# Altium project VENTUNOQ.PrjPcb (part 8 of 18)

## Sheet ETH_PHY.SchDoc: ETH PHY
size A3; Author: Silvio Navaretti; CompanyName: ARDUINO; DrawnBy: Silvio Navaretti; Engineer: Silvio Navaretti; Organization: ARDUINO; SheetNumber: 36; SheetTotal: 51; RevAuthor: Silvio Navaretti
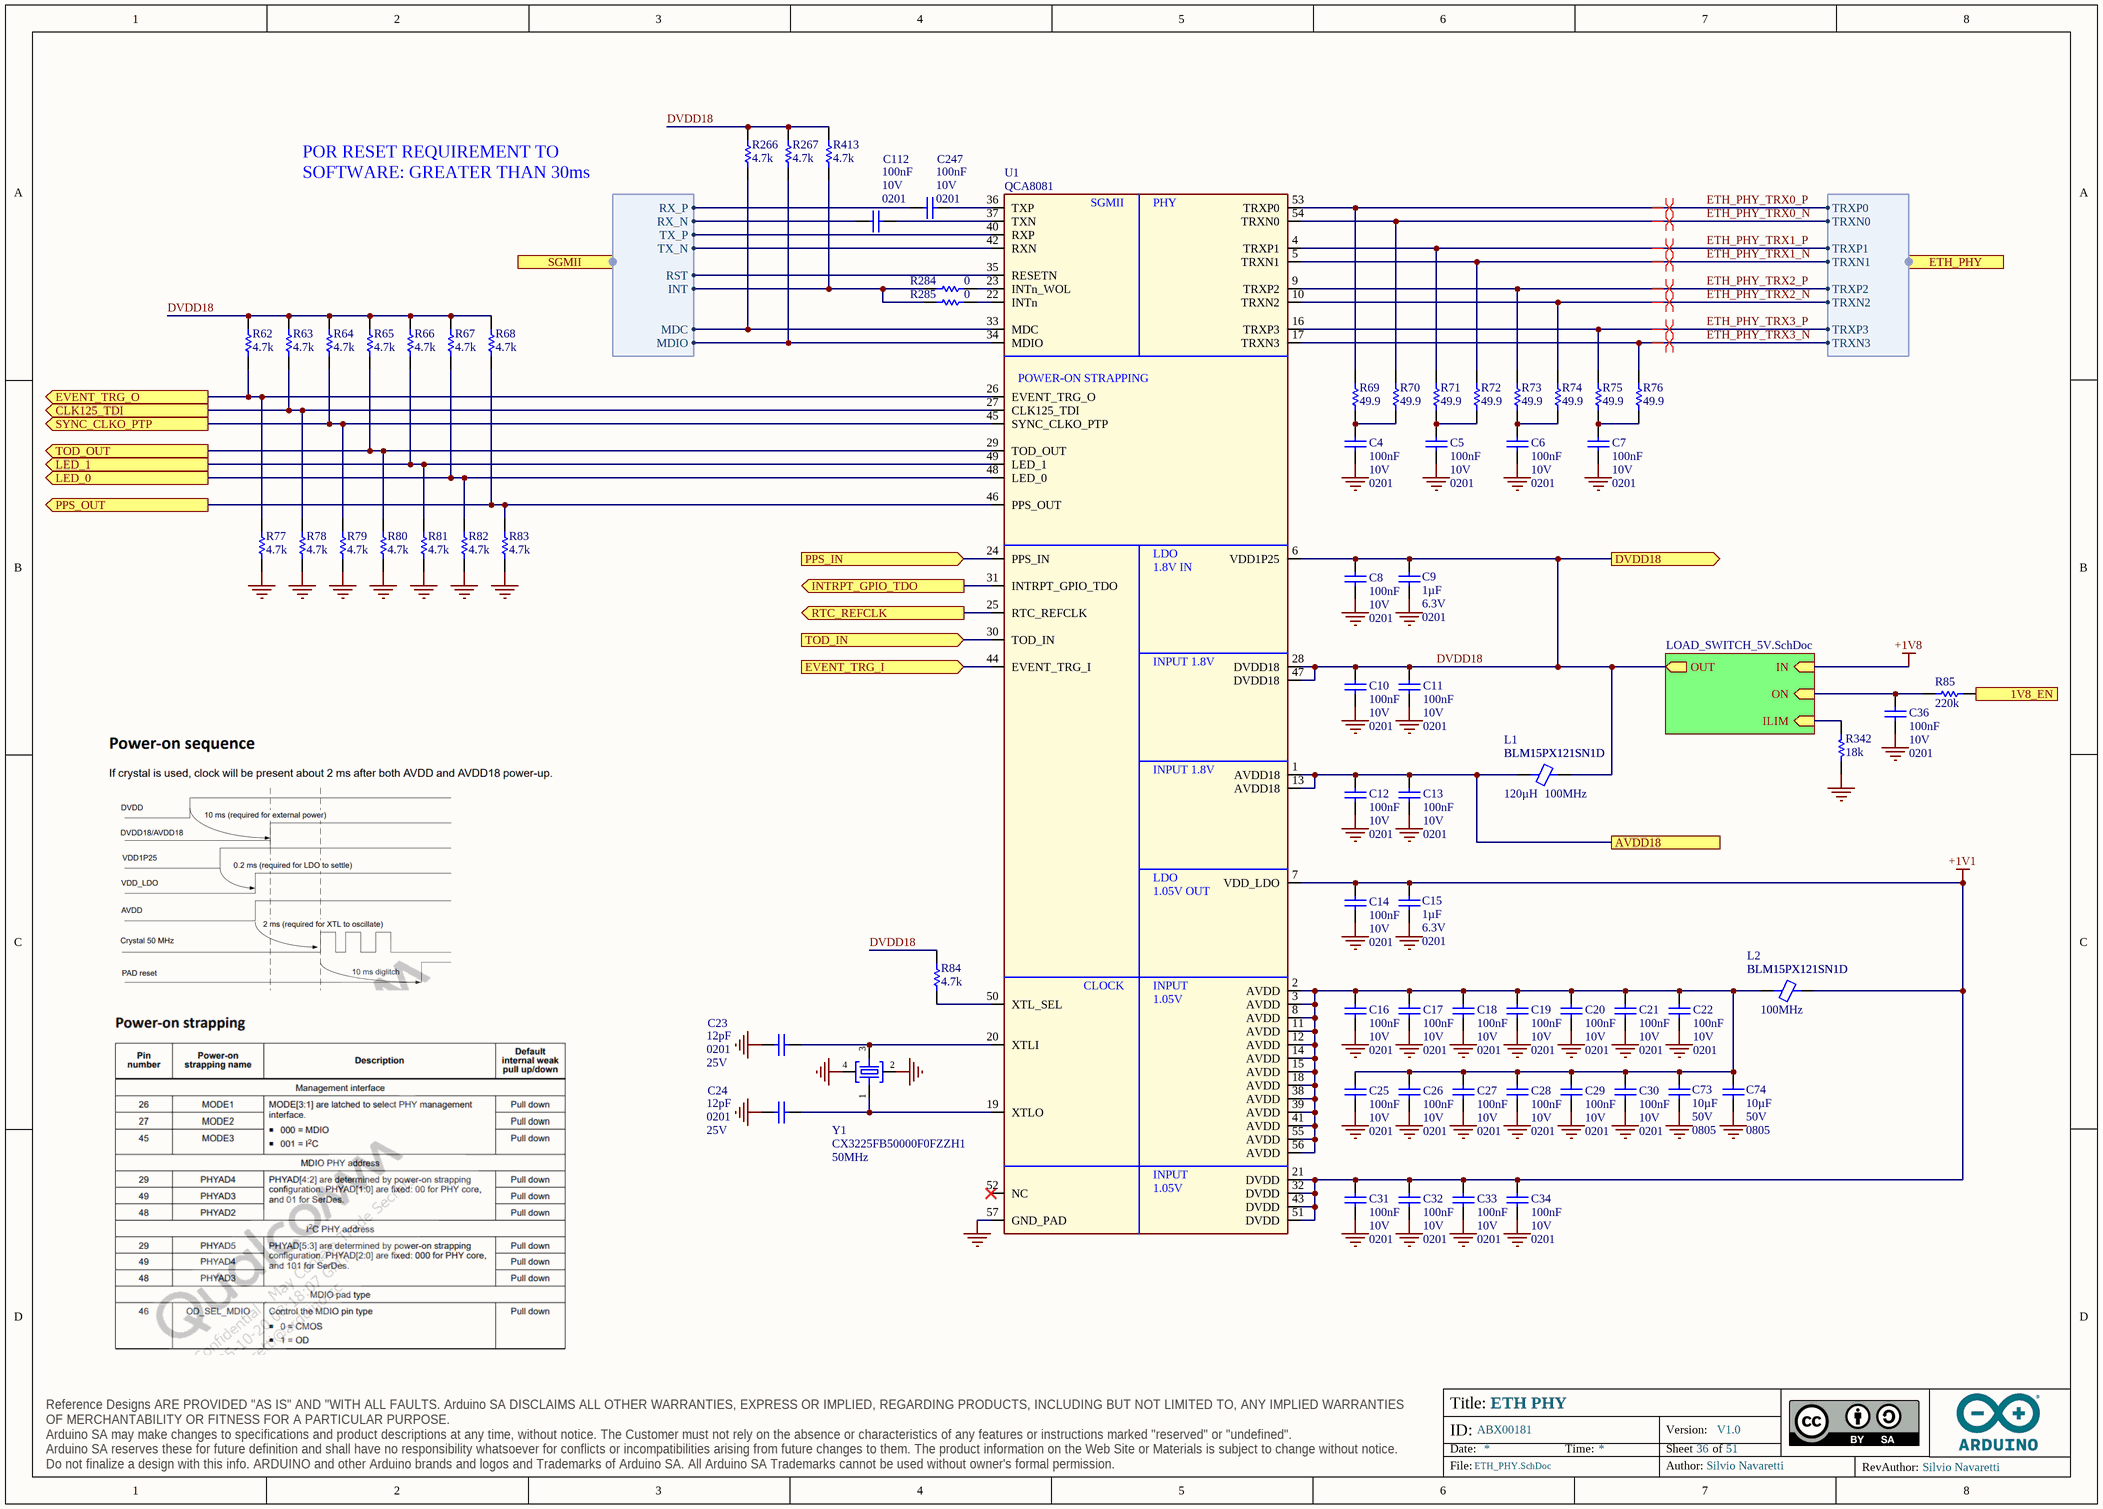
[diagram p19: ETH_PHY.SchDoc]

### Parts
C4  value 100nF  Voltage: 10V  Case Code (Imperial): 0201  [CAP-0201]  (hidden comment: CL03A104KP3NNNC)
C5  value 100nF  Voltage: 10V  Case Code (Imperial): 0201  [CAP-0201]  (hidden comment: CL03A104KP3NNNC)
C6  value 100nF  Voltage: 10V  Case Code (Imperial): 0201  [CAP-0201]  (hidden comment: CL03A104KP3NNNC)
C7  value 100nF  Voltage: 10V  Case Code (Imperial): 0201  [CAP-0201]  (hidden comment: CL03A104KP3NNNC)
C8  value 100nF  Voltage: 10V  Case Code (Imperial): 0201  [CAP-0201]  (hidden comment: CL03A104KP3NNNC)
C9  value 1µF  Voltage: 6.3V  Case Code (Imperial): 0201  [CAP-0201]  (hidden comment: GRM033R60J105MEA2D)
C10  value 100nF  Voltage: 10V  Case Code (Imperial): 0201  [CAP-0201]  (hidden comment: CL03A104KP3NNNC)
C11  value 100nF  Voltage: 10V  Case Code (Imperial): 0201  [CAP-0201]  (hidden comment: CL03A104KP3NNNC)
C12  value 100nF  Voltage: 10V  Case Code (Imperial): 0201  [CAP-0201]  (hidden comment: CL03A104KP3NNNC)
C13  value 100nF  Voltage: 10V  Case Code (Imperial): 0201  [CAP-0201]  (hidden comment: CL03A104KP3NNNC)
C14  value 100nF  Voltage: 10V  Case Code (Imperial): 0201  [CAP-0201]  (hidden comment: CL03A104KP3NNNC)
C15  value 1µF  Voltage: 6.3V  Case Code (Imperial): 0201  [CAP-0201]  (hidden comment: GRM033R60J105MEA2D)
C16  value 100nF  Voltage: 10V  Case Code (Imperial): 0201  [CAP-0201]  (hidden comment: CL03A104KP3NNNC)
C17  value 100nF  Voltage: 10V  Case Code (Imperial): 0201  [CAP-0201]  (hidden comment: CL03A104KP3NNNC)
C18  value 100nF  Voltage: 10V  Case Code (Imperial): 0201  [CAP-0201]  (hidden comment: CL03A104KP3NNNC)
C19  value 100nF  Voltage: 10V  Case Code (Imperial): 0201  [CAP-0201]  (hidden comment: CL03A104KP3NNNC)
C20  value 100nF  Voltage: 10V  Case Code (Imperial): 0201  [CAP-0201]  (hidden comment: CL03A104KP3NNNC)
C21  value 100nF  Voltage: 10V  Case Code (Imperial): 0201  [CAP-0201]  (hidden comment: CL03A104KP3NNNC)
C22  value 100nF  Voltage: 10V  Case Code (Imperial): 0201  [CAP-0201]  (hidden comment: CL03A104KP3NNNC)
C23  value 12pF  Case Code (Imperial): 0201  Voltage: 25V  [CAP-0201]  (hidden comment: GRM0335C1E120JA01J)
C24  value 12pF  Case Code (Imperial): 0201  Voltage: 25V  [CAP-0201]  (hidden comment: GRM0335C1E120JA01J)
C25  value 100nF  Voltage: 10V  Case Code (Imperial): 0201  [CAP-0201]  (hidden comment: CL03A104KP3NNNC)
C26  value 100nF  Voltage: 10V  Case Code (Imperial): 0201  [CAP-0201]  (hidden comment: CL03A104KP3NNNC)
C27  value 100nF  Voltage: 10V  Case Code (Imperial): 0201  [CAP-0201]  (hidden comment: CL03A104KP3NNNC)
C28  value 100nF  Voltage: 10V  Case Code (Imperial): 0201  [CAP-0201]  (hidden comment: CL03A104KP3NNNC)
C29  value 100nF  Voltage: 10V  Case Code (Imperial): 0201  [CAP-0201]  (hidden comment: CL03A104KP3NNNC)
C30  value 100nF  Voltage: 10V  Case Code (Imperial): 0201  [CAP-0201]  (hidden comment: CL03A104KP3NNNC)
C31  value 100nF  Voltage: 10V  Case Code (Imperial): 0201  [CAP-0201]  (hidden comment: CL03A104KP3NNNC)
C32  value 100nF  Voltage: 10V  Case Code (Imperial): 0201  [CAP-0201]  (hidden comment: CL03A104KP3NNNC)
C33  value 100nF  Voltage: 10V  Case Code (Imperial): 0201  [CAP-0201]  (hidden comment: CL03A104KP3NNNC)
C34  value 100nF  Voltage: 10V  Case Code (Imperial): 0201  [CAP-0201]  (hidden comment: CL03A104KP3NNNC)
C36  value 100nF  Voltage: 10V  Case Code (Imperial): 0201  [CAP-0201]  (hidden comment: CL03A104KP3NNNC)
C73  value 10µF  Voltage: 50V  Case Code (Imperial): 0805  [CAP-0805]  (hidden comment: GRM21BR61H106ME43L)
C74  value 10µF  Voltage: 50V  Case Code (Imperial): 0805  [CAP-0805]  (hidden comment: GRM21BR61H106ME43L)
C112  value 100nF  Voltage: 10V  Case Code (Imperial): 0201  [CAP-0201]  (hidden comment: CL03A104KP3NNNC)
C247  value 100nF  Voltage: 10V  Case Code (Imperial): 0201  [CAP-0201]  (hidden comment: CL03A104KP3NNNC)
L1  BLM15PX121SN1D  Inductance: 120µH  Test Frequency: 100MHz  [L-0402]
L2  BLM15PX121SN1D  Test Frequency: 100MHz  [L-0402]
R62  value 4.7k  [RES-0201]  (hidden comment: RC0201FR-074K7L)
R63  value 4.7k  [RES-0201]  (hidden comment: RC0201FR-074K7L)
R64  value 4.7k  [RES-0201]  (hidden comment: RC0201FR-074K7L)
R65  value 4.7k  [RES-0201]  (hidden comment: RC0201FR-074K7L)
R66  value 4.7k  [RES-0201]  (hidden comment: RC0201FR-074K7L)
R67  value 4.7k  [RES-0201]  (hidden comment: RC0201FR-074K7L)
R68  value 4.7k  [RES-0201]  (hidden comment: RC0201FR-074K7L)
R69  value 49.9  [RES-0201]  (hidden comment: AC0201FR-0749R9L)
R70  value 49.9  [RES-0201]  (hidden comment: AC0201FR-0749R9L)
R71  value 49.9  [RES-0201]  (hidden comment: AC0201FR-0749R9L)
R72  value 49.9  [RES-0201]  (hidden comment: AC0201FR-0749R9L)
R73  value 49.9  [RES-0201]  (hidden comment: AC0201FR-0749R9L)
R74  value 49.9  [RES-0201]  (hidden comment: AC0201FR-0749R9L)
R75  value 49.9  [RES-0201]  (hidden comment: AC0201FR-0749R9L)
R76  value 49.9  [RES-0201]  (hidden comment: AC0201FR-0749R9L)
R77  value 4.7k  [RES-0201]  (hidden comment: RC0201FR-074K7L)
R78  value 4.7k  [RES-0201]  (hidden comment: RC0201FR-074K7L)
R79  value 4.7k  [RES-0201]  (hidden comment: RC0201FR-074K7L)
R80  value 4.7k  [RES-0201]  (hidden comment: RC0201FR-074K7L)
R81  value 4.7k  [RES-0201]  (hidden comment: RC0201FR-074K7L)
R82  value 4.7k  [RES-0201]  (hidden comment: RC0201FR-074K7L)
R83  value 4.7k  [RES-0201]  (hidden comment: RC0201FR-074K7L)
R84  value 4.7k  [RES-0201]  (hidden comment: RC0201FR-074K7L)
R85  value 220k  [RES-0201]  (hidden comment: AC0201FR-07220KL)
R266  value 4.7k  [RES-0201]  (hidden comment: RC0201FR-074K7L)
R267  value 4.7k  [RES-0201]  (hidden comment: RC0201FR-074K7L)
R284  value 0  [RES-0201]  (hidden comment: CRCW02010000Z0ED)
R285  value 0  [RES-0201]  (hidden comment: CRCW02010000Z0ED)
R342  value 18k  [RES-0201]  (hidden comment: RC0201FR-0718KL)
R413  value 4.7k  [RES-0201]  (hidden comment: RC0201FR-074K7L)
U1  QCA8081  [Qualcomm QCA8081 56 MQFN 7x7mm pitch 0.4mm]
Y1  CX3225FB50000F0FZZH1  Frequency: 50MHz  [CRYSTAL3.2X2.5]

### Sub-sheets
U_LOAD_SWITCH_5V = LOAD_SWITCH_5V.SchDoc: IN (in), OUT (out), ON (in), ILIM (in)

### Ports
1V8_EN (in), AVDD18, CLK125_TDI (out), DVDD18 (out), ETH_PHY (harness ETH_QCA8081), EVENT_TRG_I (in), EVENT_TRG_O (out), INTRPT_GPIO_TDO (out), LED_0 (out), LED_1 (out), PPS_IN (in), PPS_OUT (out), RTC_REFCLK (out), SGMII (harness SOM_MD_SGMII0), SYNC_CLKO_PTP (out), TOD_IN (in), TOD_OUT (out)

### Harnesses
ETH_QCA8081: TRXP1, TRXN1, TRXP0, TRXN0, TRXP2, TRXN2, TRXP3, TRXN3
SOM_MD_SGMII0: RX_P, RX_N, TX_P, TX_N, RST, MDC, INT, MDIO

### Nets
+1V1: C14.2 C15.2 C31.2 C32.2 C33.2 C34.2 L2.2 U1.7(VDD_LDO) U1.21(DVDD) U1.32(DVDD) U1.43(DVDD) U1.51(DVDD)
GND: C4.1 C5.1 C6.1 C7.1 C8.1 C9.1 C10.1 C11.1 C12.1 C13.1 C14.1 C15.1 C16.1 C17.1 C18.1 C19.1 C20.1 C21.1 C22.1 C23.2 C24.2 C25.1 C26.1 C27.1 C28.1 C29.1 C30.1 C31.1 C32.1 C33.1 C34.1 C36.1 C73.2 C74.2 R77.1 R78.1 R79.1 R80.1 R81.1 R82.1 R83.1 R342.1 U1.57(GND_PAD) Y1.2 Y1.4
1V05_PG (PULLUP 1V8): R85.1 ; port 1V8_EN
DVDD18: C8.2 C9.2 C10.2 C11.2 L1.2 R62.2 R63.2 R64.2 R65.2 R66.2 R67.2 R68.2 R84.2 R266.2 R267.2 R413.2 U1.6(VDD1P25) U1.28(DVDD18) U1.47(DVDD18) ; port DVDD18, sheet U_LOAD_SWITCH_5V/OUT
ETH_PHY_TRX0_N: R70.2 U1.54(TRXN0) ; port ETH_PHY.TRXN0
ETH_PHY_TRX0_P: R69.2 U1.53(TRXP0) ; port ETH_PHY.TRXP0
ETH_PHY_TRX1_N: R72.2 U1.5(TRXN1) ; port ETH_PHY.TRXN1
ETH_PHY_TRX1_P: R71.2 U1.4(TRXP1) ; port ETH_PHY.TRXP1
ETH_PHY_TRX2_N: R74.2 U1.10(TRXN2) ; port ETH_PHY.TRXN2
ETH_PHY_TRX2_P: R73.2 U1.9(TRXP2) ; port ETH_PHY.TRXP2
ETH_PHY_TRX3_N: R76.2 U1.17(TRXN3) ; port ETH_PHY.TRXN3
ETH_PHY_TRX3_P: R75.2 U1.16(TRXP3) ; port ETH_PHY.TRXP3
GPIO_4: R284.1 R285.1 R413.1 ; port SGMII.INT
GPIO_5: R266.1 U1.33(MDC) ; port SGMII.MDC
GPIO_6: R267.1 U1.34(MDIO) ; port SGMII.MDIO
GPIO_50: U1.35(RESETN) ; port SGMII.RST
MD_SGMII0.RX_N: C112.2 ; port SGMII.RX_N
MD_SGMII0.RX_P: C247.2 ; port SGMII.RX_P
MD_SGMII0.TX_N: U1.42(RXN) ; port SGMII.TX_N
MD_SGMII0.TX_P: U1.40(RXP) ; port SGMII.TX_P
NetC4_2: C4.2 R69.1 R70.1
NetC5_2: C5.2 R71.1 R72.1
NetC6_2: C6.2 R73.1 R74.1
NetC7_2: C7.2 R75.1 R76.1
NetC12_2: C12.2 C13.2 L1.1 U1.1(AVDD18) U1.13(AVDD18) ; port AVDD18
NetC16_2: C16.2 C17.2 C18.2 C19.2 C20.2 C21.2 C22.2 C25.2 C26.2 C27.2 C28.2 C29.2 C30.2 C73.1 C74.1 L2.1 U1.2(AVDD) U1.3(AVDD) U1.8(AVDD) U1.11(AVDD) U1.12(AVDD) U1.14(AVDD) U1.15(AVDD) U1.18(AVDD) U1.38(AVDD) U1.39(AVDD) U1.41(AVDD) U1.55(AVDD) U1.56(AVDD)
NetC23_1: C23.1 U1.20(XTLI) Y1.3
NetC24_1: C24.1 U1.19(XTLO) Y1.1
NetC36_2: C36.2 R85.2 ; sheet U_LOAD_SWITCH_5V/ON
NetC112_1: C112.1 U1.37(TXN)
NetC247_1: C247.1 U1.36(TXP)
NetR62_1: R62.1 R77.2 U1.26(EVENT_TRG_O) ; port EVENT_TRG_O
NetR63_1: R63.1 R78.2 U1.27(CLK125_TDI) ; port CLK125_TDI
NetR64_1: R64.1 R79.2 U1.45(SYNC_CLKO_PTP) ; port SYNC_CLKO_PTP
NetR65_1: R65.1 R80.2 U1.29(TOD_OUT) ; port TOD_OUT
NetR66_1: R66.1 R81.2 U1.49(LED_1) ; port LED_1
NetR67_1: R67.1 R82.2 U1.48(LED_0) ; port LED_0
NetR68_1: R68.1 R83.2 U1.46(PPS_OUT) ; port PPS_OUT
NetR84_1: R84.1 U1.50(XTL_SEL)
NetR284_2: R284.2 U1.23(INTn_WOL)
NetR285_2: R285.2 U1.22(INTn)
NetR342_2: R342.2 ; sheet U_LOAD_SWITCH_5V/ILIM
NetTP40_X: U1.44(EVENT_TRG_I) ; port EVENT_TRG_I
NetTP41_X: U1.30(TOD_IN) ; port TOD_IN
NetTP42_X: U1.24(PPS_IN) ; port PPS_IN
NetTP43_X: U1.25(RTC_REFCLK) ; port RTC_REFCLK
NetTP49_X: U1.31(INTRPT_GPIO_TDO) ; port INTRPT_GPIO_TDO

Not connected (* = marked no-connect by the designer): U1 52(NC)*

### Layout directives
differential pair; differential pair class DIFF_ETHPHY; net class DIFF_ETHPHY: ETH_PHY_TRX0_N, ETH_PHY_TRX0_P, ETH_PHY_TRX1_N, ETH_PHY_TRX1_P, ETH_PHY_TRX2_N, ETH_PHY_TRX2_P, ETH_PHY_TRX3_N, ETH_PHY_TRX3_P

### Notes on the sheet
- POR RESET REQUIREMENT TO SOFTWARE: GREATER THAN 30ms
- Title:
- ID:
- Date:
- Time:
- Version:
- Sheet
- of
- RevAuthor:
- Reference Designs ARE PROVIDED "AS IS" AND "WITH ALL FAULTS. Arduino SA DISCLAIMS ALL OTHER WARRANTIES, EXPRESS OR IMPLIED, REGARDING PRODUCTS, INCLUDING BUT NOT LIMITED TO, ANY IMPLIED WARRANTIES OF MERCHANTABILITY OR FITNESS FOR A PARTICULAR PURPOSE.
  Arduino SA may make changes to specifications and product descriptions at any time, without notice. The Customer must not rely on the absence or characteristics of any features or instructions marked "reserved" or "undefined".
  Arduino SA reserves these for future definition and shall have no responsibility whatsoever for conflicts or incompatibilities arising from future changes to them. The product information on the Web Site or Materials is subject to change without notice.
  Do not finalize a design with this info. ARDUINO and other Arduino brands and logos and Trademarks of Arduino SA. All Arduino SA Trademarks cannot be used without owner's formal permission.
- File:
- Author:
- (in symbol U0492-A.6) SGMII; PHY; POWER-ON STRAPPING; LDO / 1.8V IN; INPUT 1.8V; LDO / 1.05V OUT; CLOCK; INPUT 1.05V

### Library data of the parts
C4-C8 C10-C14 C16-C22 C25-C34 C36 C112 C247 = C0113-A.6: CAP CHIP 0201 100nF 10% 10V X5R; Manufacturer: Samsung Electro-Mechanics; Code Arduino: C0113; Technology: Ceramic; Part Number: CL03A104KP3NNNC; Dielectric: X5R; Tolerance: 10%
C9 C15 = C0002-A.15: CAP CHIP 0201 1uF 20% 6.3V X5R; Manufacturer: Murata; Code Arduino: A5520; Tolerance: 20%; Dielectric: X5R; Part Number: GRM033R60J105MEA2D; Technology: Ceramic
C23 C24 = C0003-A.15: CAP CHIP 0201 12pF 5% 25V C0G; Manufacturer: Murata; Code Arduino: C0003; Technology: Ceramic; Part Number: GRM0335C1E120JA01J; Tolerance: 5%; Dielectric: C0G
C73 C74 = C0158-A.3: CAP CHIP 0805 10uF 20% 50V X5R; Manufacturer: Murata Electronics; Code Arduino: C0158; Technology: SMD; Dielectric: X5R; Tolerance: 20%; Part Number: GRM21BR61H106ME43L
L1 = I0028-A.10: FERRITE SMD 0402 120Ohm 25% 100MHz Ferrite 2A; Manufacturer: Murata; DC Resistance (DCR): 55mR; Code Arduino: I0028; Value: 120µH; Part Number: BLM15PX121SN1D; Device Type: Ferrite; Packaging: Tape and Reel; Case Code (Imperial): 0402; Max DC Current: 2A; Case Code (Metric): 1005; Package Quantity: 10000; Current: 2A; Max Operating Temperature: 125°C; Tolerance: 25%; Min Operating Temperature: -55°C
L2 = I0028-A.10: FERRITE SMD 0402 120Ohm 25% 100MHz Ferrite 2A; Manufacturer: Murata; Inductance: 120µH; DC Resistance (DCR): 55mR; Code Arduino: I0028; Value: 120µH; Part Number: BLM15PX121SN1D; Device Type: Ferrite; Packaging: Tape and Reel; Case Code (Imperial): 0402; Max DC Current: 2A; Case Code (Metric): 1005; Package Quantity: 10000; Current: 2A; Max Operating Temperature: 125°C; Tolerance: 25%; Min Operating Temperature: -55°C
R62-R68 R77-R84 R266 R267 R413 = R0151-A.21: RES CHIP 0201 4k7 1% 1/20W; Manufacturer: Yageo; Temperature coefficient: 200ppm; Power: 50mW; Code Arduino: A5521; Technology: Thick film; Case Code (Imperial): 0201; Part Number: RC0201FR-074K7L; Tolerance: 1%
R69-R76 = R0152-A.22: RES CHIP 0201 49R9 1% 1/20W; Manufacturer: Yageo; Temperature coefficient: 200ppm; Power: 50mW; Code Arduino: R0152; Technology: Thick film; Tolerance: 1%; Part Number: AC0201FR-0749R9L; Case Code (Imperial): 0201
R85 = R0199-A.20: RES CHIP 0201 220k 1% 1/20W; Manufacturer: Yageo; Temperature coefficient: 200ppm; Power: 50mW; Code Arduino: R0199; Part Number: AC0201FR-07220KL; Tolerance: 1%; Case Code (Imperial): 0201; Technology: Thick film
R284 R285 = R0140-A.21: RES CHIP 0201 0R; Manufacturer: Vishay; Temperature coefficient: 0ppm; Code Arduino: R0140; Power: 50mW; Tolerance: 0%; Technology: Thick film; Case Code (Imperial): 0201; Part Number: CRCW02010000Z0ED
R342 = R0399-A.1: RES CHIP 0201 18k 1% 1/20W; Manufacturer: YAGEO; Power: 50mW; Code Arduino: R0399; Temperature Coefficient: 200ppm; Technology: Thick film; Tolerance: 1%; Case Code (Imperial): 0201; Part Number: RC0201FR-0718KL
U1 = U0492-A.6: IC ETH PHY 2.5Gb, 7x7mm MQFN56; Manufacturer: Qualcomm; Code Arduino: U0492; Part Number: QCA8081
Y1 = X0031-A.3: CRYSTAL 50MHz tolerance 10ppm stability 20ppm load 10pF 3.2x2.5mm; Manufacturer: Kyocera; Code Arduino: X0031; Series Resistance: 22R; Frequency Tolerance: 10ppm; Load Capacitance: 10pF; Frequency Stability: 20ppm; Max Operating Temperature: 105°C; Part Number: CX3225FB50000F0FZZH1; Min Operating Temperature: -40°C

## Sheet ETH_RJ45.SchDoc: ETH RJ45
size A3; Author: Silvio Navaretti; CompanyName: ARDUINO; DrawnBy: Silvio Navaretti; Engineer: Silvio Navaretti; Organization: ARDUINO; SheetNumber: 37; SheetTotal: 51; RevAuthor: Silvio Navaretti
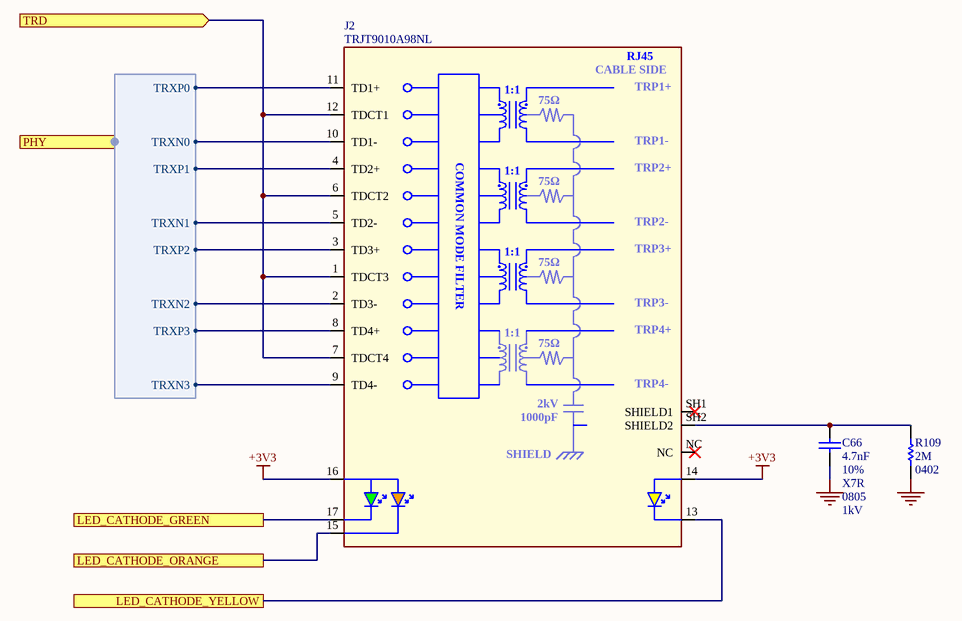
[diagram p20: ETH_RJ45.SchDoc]

### Parts
C66  value 4.7nF  Tolerance: 10%  Dielectric: X7R  Case Code (Imperial): 0805  Voltage: 1kV  [CAP-0805]  (hidden comment: FV21X472K102ECG)
J2  TRJT9010A98NL  [TRJT9010A98NL]
R109  value 2M  Case Code (Imperial): 0402  [RES-0402]  (hidden comment: RC0402FR-072ML)

### Ports
LED_CATHODE_GREEN, LED_CATHODE_ORANGE, LED_CATHODE_YELLOW, PHY (harness ETH_QCA8081), TRD (in)

### Harnesses
ETH_QCA8081: TRXP1, TRXN1, TRXP0, TRXN0, TRXP2, TRXN2, TRXP3, TRXN3

### Nets
+3V3: J2.14(YELLOW_ANODE) J2.16(COMMON_ANODE)
GND: C66.2 R109.1
ETH_PHY_TRX0_N: J2.10(TD1-) ; port PHY.TRXN0
ETH_PHY_TRX0_P: J2.11(TD1+) ; port PHY.TRXP0
ETH_PHY_TRX1_N: J2.5(TD2-) ; port PHY.TRXN1
ETH_PHY_TRX1_P: J2.4(TD2+) ; port PHY.TRXP1
ETH_PHY_TRX2_N: J2.2(TD3-) ; port PHY.TRXN2
ETH_PHY_TRX2_P: J2.3(TD3+) ; port PHY.TRXP2
ETH_PHY_TRX3_N: J2.9(TD4-) ; port PHY.TRXN3
ETH_PHY_TRX3_P: J2.8(TD4+) ; port PHY.TRXP3
NetC12_2: J2.1(TDCT3) J2.6(TDCT2) J2.7(TDCT4) J2.12(TDCT1) ; port TRD
NetC66_1: C66.1 J2.SH2(SHIELD2) R109.2
NetJ2_13: J2.13(YELLOW_CATHODE) ; port LED_CATHODE_YELLOW
NetJ2_15: J2.15(ORANGE_CATHODE) ; port LED_CATHODE_ORANGE
NetJ2_17: J2.17(GREEN_CATHODE) ; port LED_CATHODE_GREEN

Not connected (* = marked no-connect by the designer): J2 NC* SH1(SHIELD1)*

### Notes on the sheet
- Title:
- ID:
- Date:
- Time:
- Version:
- Sheet
- of
- RevAuthor:
- Reference Designs ARE PROVIDED "AS IS" AND "WITH ALL FAULTS. Arduino SA DISCLAIMS ALL OTHER WARRANTIES, EXPRESS OR IMPLIED, REGARDING PRODUCTS, INCLUDING BUT NOT LIMITED TO, ANY IMPLIED WARRANTIES OF MERCHANTABILITY OR FITNESS FOR A PARTICULAR PURPOSE.
  Arduino SA may make changes to specifications and product descriptions at any time, without notice. The Customer must not rely on the absence or characteristics of any features or instructions marked "reserved" or "undefined".
  Arduino SA reserves these for future definition and shall have no responsibility whatsoever for conflicts or incompatibilities arising from future changes to them. The product information on the Web Site or Materials is subject to change without notice.
  Do not finalize a design with this info. ARDUINO and other Arduino brands and logos and Trademarks of Arduino SA. All Arduino SA Trademarks cannot be used without owner's formal permission.
- File:
- Author:
- (in symbol J0561-A.4) RJ45; CABLE SIDE; TRP1+; 1:1; 75Ω; TRP1-; TRP2+; TRP2-; COMMON MODE FILTER; TRP3+; TRP3-; TRP4+; TRP4-; 2kV; 1000pF; SHIELD

### Library data of the parts
C66 = C0059-A.14: CAP CHIP 0805 4.7nF 10% 1000V X7R; Manufacturer: PSA Shenzen; Code Arduino: 0689; Technology: Ceramic; Manufacturer 3: KEMET; Manufacturer 2: KEMET; Part number 2: C0805V472KDRACTU; Part number 3: C0805C472KDRACTU; Part Number: FV21X472K102ECG
J2 = J0561-A.4: CONN ETH 1x1 RJ45 TH 10/100/1000/2500 integrated magnetics, LED GREEN/YELLOW/ORANGE, micro profile 17.8x24.2x11.55mm; Manufacturer: TRXCOM; Code Arduino: J0561; Part Number: TRJT9010A98NL
R109 = R0394-A.1: RES CHIP 0402 2M 1% 1/16W; Manufacturer: YAGEO; Temperature coefficient: 100ppm; Code Arduino: R0394; Power: 62.5mW; Technology: Thick film; Part Number: RC0402FR-072ML; Tolerance: 1%

## Sheet HEADERS_UNO.SchDoc: HEADERS UNO
size A3; Author: Silvio Navaretti; CompanyName: ARDUINO; DrawnBy: Silvio Navaretti; Engineer: Silvio Navaretti; Organization: ARDUINO; SheetNumber: 19; SheetTotal: 51; RevAuthor: Silvio Navaretti
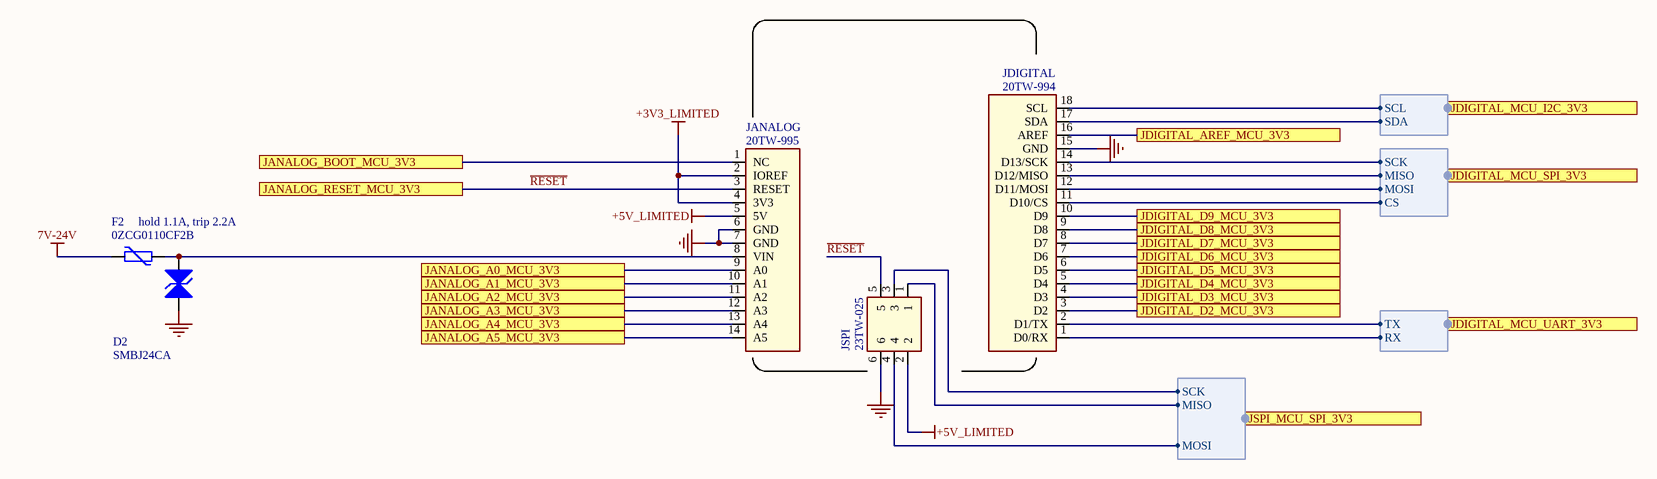
[diagram p21: HEADERS_UNO.SchDoc]

### Parts
D2  SMBJ24CA  [SMB_NOPOLARITY]
F2  0ZCG0110CF2B  [1812]
JANALOG  20TW-995  [1X14-CUSTOM]
JDIGITAL  20TW-994  [1X18-CUSTOM]
JSPI  23TW-025  [23TW-025]

### Ports
JANALOG_A0_MCU_3V3, JANALOG_A1_MCU_3V3, JANALOG_A2_MCU_3V3, JANALOG_A3_MCU_3V3, JANALOG_A4_MCU_3V3, JANALOG_A5_MCU_3V3, JANALOG_BOOT_MCU_3V3, JANALOG_RESET_MCU_3V3, JDIGITAL_AREF_MCU_3V3, JDIGITAL_D2_MCU_3V3, JDIGITAL_D3_MCU_3V3, JDIGITAL_D4_MCU_3V3, JDIGITAL_D5_MCU_3V3, JDIGITAL_D6_MCU_3V3, JDIGITAL_D7_MCU_3V3, JDIGITAL_D8_MCU_3V3, JDIGITAL_D9_MCU_3V3, JDIGITAL_MCU_I2C_3V3 (harness I2C), JDIGITAL_MCU_SPI_3V3 (harness SPI), JDIGITAL_MCU_UART_3V3 (harness UART), JSPI_MCU_SPI_3V3 (harness JSPI_SPI)

### Harnesses
SPI: SCK, MISO, MOSI, CS
UART: TX, RX
I2C: SDA, SCL
JSPI_SPI: SCK, MISO, MOSI

### Nets
7V-24V: F2.1
+3V3_LIMITED: JANALOG.2(IOREF) JANALOG.4(3V3)
+5V_LIMITED: JANALOG.5(5V) JSPI.2
GND: D2.1(A1) JANALOG.6(GND) JANALOG.7(GND) JDIGITAL.15(GND) JSPI.6
BOOT0: JANALOG.1(NC) ; port JANALOG_BOOT_MCU_3V3
PA4: JANALOG.9(A0) ; port JANALOG_A0_MCU_3V3
PA5: JANALOG.10(A1) ; port JANALOG_A1_MCU_3V3
PB0: JDIGITAL.3(D2) ; port JDIGITAL_D2_MCU_3V3
PB1: JDIGITAL.4(D3) ; port JDIGITAL_D3_MCU_3V3
PB2: JDIGITAL.7(D6) ; port JDIGITAL_D6_MCU_3V3
PB3: JDIGITAL.8(D7) ; port JDIGITAL_D7_MCU_3V3
PB4: JDIGITAL.9(D8) ; port JDIGITAL_D8_MCU_3V3
PB5: JDIGITAL.6(D5) ; port JDIGITAL_D5_MCU_3V3
PB6: JDIGITAL.5(D4) ; port JDIGITAL_D4_MCU_3V3
PB7: JDIGITAL.10(D9) ; port JDIGITAL_D9_MCU_3V3
PB10: JDIGITAL.2(D1/TX) ; port JDIGITAL_MCU_UART_3V3.TX
PB11: JDIGITAL.1(D0/RX) ; port JDIGITAL_MCU_UART_3V3.RX
PB12: JDIGITAL.11(D10/CS) ; port JDIGITAL_MCU_SPI_3V3.CS
PB13: JDIGITAL.14(D13/SCK) ; port JDIGITAL_MCU_SPI_3V3.SCK
PB14: JDIGITAL.13(D12/MISO) ; port JDIGITAL_MCU_SPI_3V3.MISO
PB15: JDIGITAL.12(D11/MOSI) ; port JDIGITAL_MCU_SPI_3V3.MOSI
PC10: JSPI.3 ; port JSPI_MCU_SPI_3V3.SCK
PC12: JSPI.4 ; port JSPI_MCU_SPI_3V3.MOSI
PE12: JANALOG.11(A2) ; port JANALOG_A2_MCU_3V3
PE13: JANALOG.12(A3) ; port JANALOG_A3_MCU_3V3
PE14: JANALOG.13(A4) ; port JANALOG_A4_MCU_3V3
PE15: JANALOG.14(A5) ; port JANALOG_A5_MCU_3V3
PF14: JSPI.1 ; port JSPI_MCU_SPI_3V3.MISO
PH11: JDIGITAL.18(SCL) ; port JDIGITAL_MCU_I2C_3V3.SCL
PH12: JDIGITAL.17(SDA) ; port JDIGITAL_MCU_I2C_3V3.SDA
~{RESET}: JANALOG.3(RESET) JSPI.5 ; port JANALOG_RESET_MCU_3V3  [project net NRST]
NetC107_2: JDIGITAL.16(AREF) ; port JDIGITAL_AREF_MCU_3V3
NetD2_2: D2.2(A2) F2.2 JANALOG.8(VIN)

### Notes on the sheet
- hold 1.1A, trip 2.2A
- Title:
- ID:
- Date:
- Time:
- Version:
- Sheet
- of
- RevAuthor:
- Reference Designs ARE PROVIDED "AS IS" AND "WITH ALL FAULTS. Arduino SA DISCLAIMS ALL OTHER WARRANTIES, EXPRESS OR IMPLIED, REGARDING PRODUCTS, INCLUDING BUT NOT LIMITED TO, ANY IMPLIED WARRANTIES OF MERCHANTABILITY OR FITNESS FOR A PARTICULAR PURPOSE.
  Arduino SA may make changes to specifications and product descriptions at any time, without notice. The Customer must not rely on the absence or characteristics of any features or instructions marked "reserved" or "undefined".
  Arduino SA reserves these for future definition and shall have no responsibility whatsoever for conflicts or incompatibilities arising from future changes to them. The product information on the Web Site or Materials is subject to change without notice.
  Do not finalize a design with this info. ARDUINO and other Arduino brands and logos and Trademarks of Arduino SA. All Arduino SA Trademarks cannot be used without owner's formal permission.
- File:
- Author:

### Library data of the parts
D2 = D0070-A.2: TVS BIDIRECTIONAL SMD Vr 24V, Vbr min 26.7V, 600W, SMB; Manufacturer: Littlefuse; V(BR) Typ (V): 26.7; Code Arduino: D0070; Manufacturer 2: Bourns; Part Number: SMBJ24CA; Manufacturer 3: Hottech
F2 = P0027-A.1: PTC Ihold 1.1A Itrip 2.2A 33V 1812; Manufacturer: Bel Fuse; Code Arduino: P0027; Part Number: 0ZCG0110CF2B
JANALOG = J0063-A.10: JANALOG UNO header 2.54mm with 8+6 pins, custom 5.08mm pitch between them, custom silkscreen print on side; Manufacturer: 4UCONN; Code Arduino: 3649; Part Number: 20TW-995
JDIGITAL = J0035-A.13: JDIGITAL UNO header 2.54mm with 8+10 pins, custom 4.06mm pitch between them, custom silkscreen print on side; Manufacturer: 4UCONN; Code Arduino: 3648; Part Number: 20TW-994
JSPI = J0569-A.3: CONN HEADER MALE 6POS 2x3 2.54mm SMD; Manufacturer: 4UCONN; Number of Contacts: 6; Code Arduino: J0569; Part Number: 23TW-025

## Sheet POWER.SchDoc: POWER
size A3; Author: Silvio Navaretti; CompanyName: ARDUINO; DrawnBy: Silvio Navaretti; Engineer: Silvio Navaretti; Organization: ARDUINO; SheetNumber: 38; SheetTotal: 51; RevAuthor: Silvio Navaretti
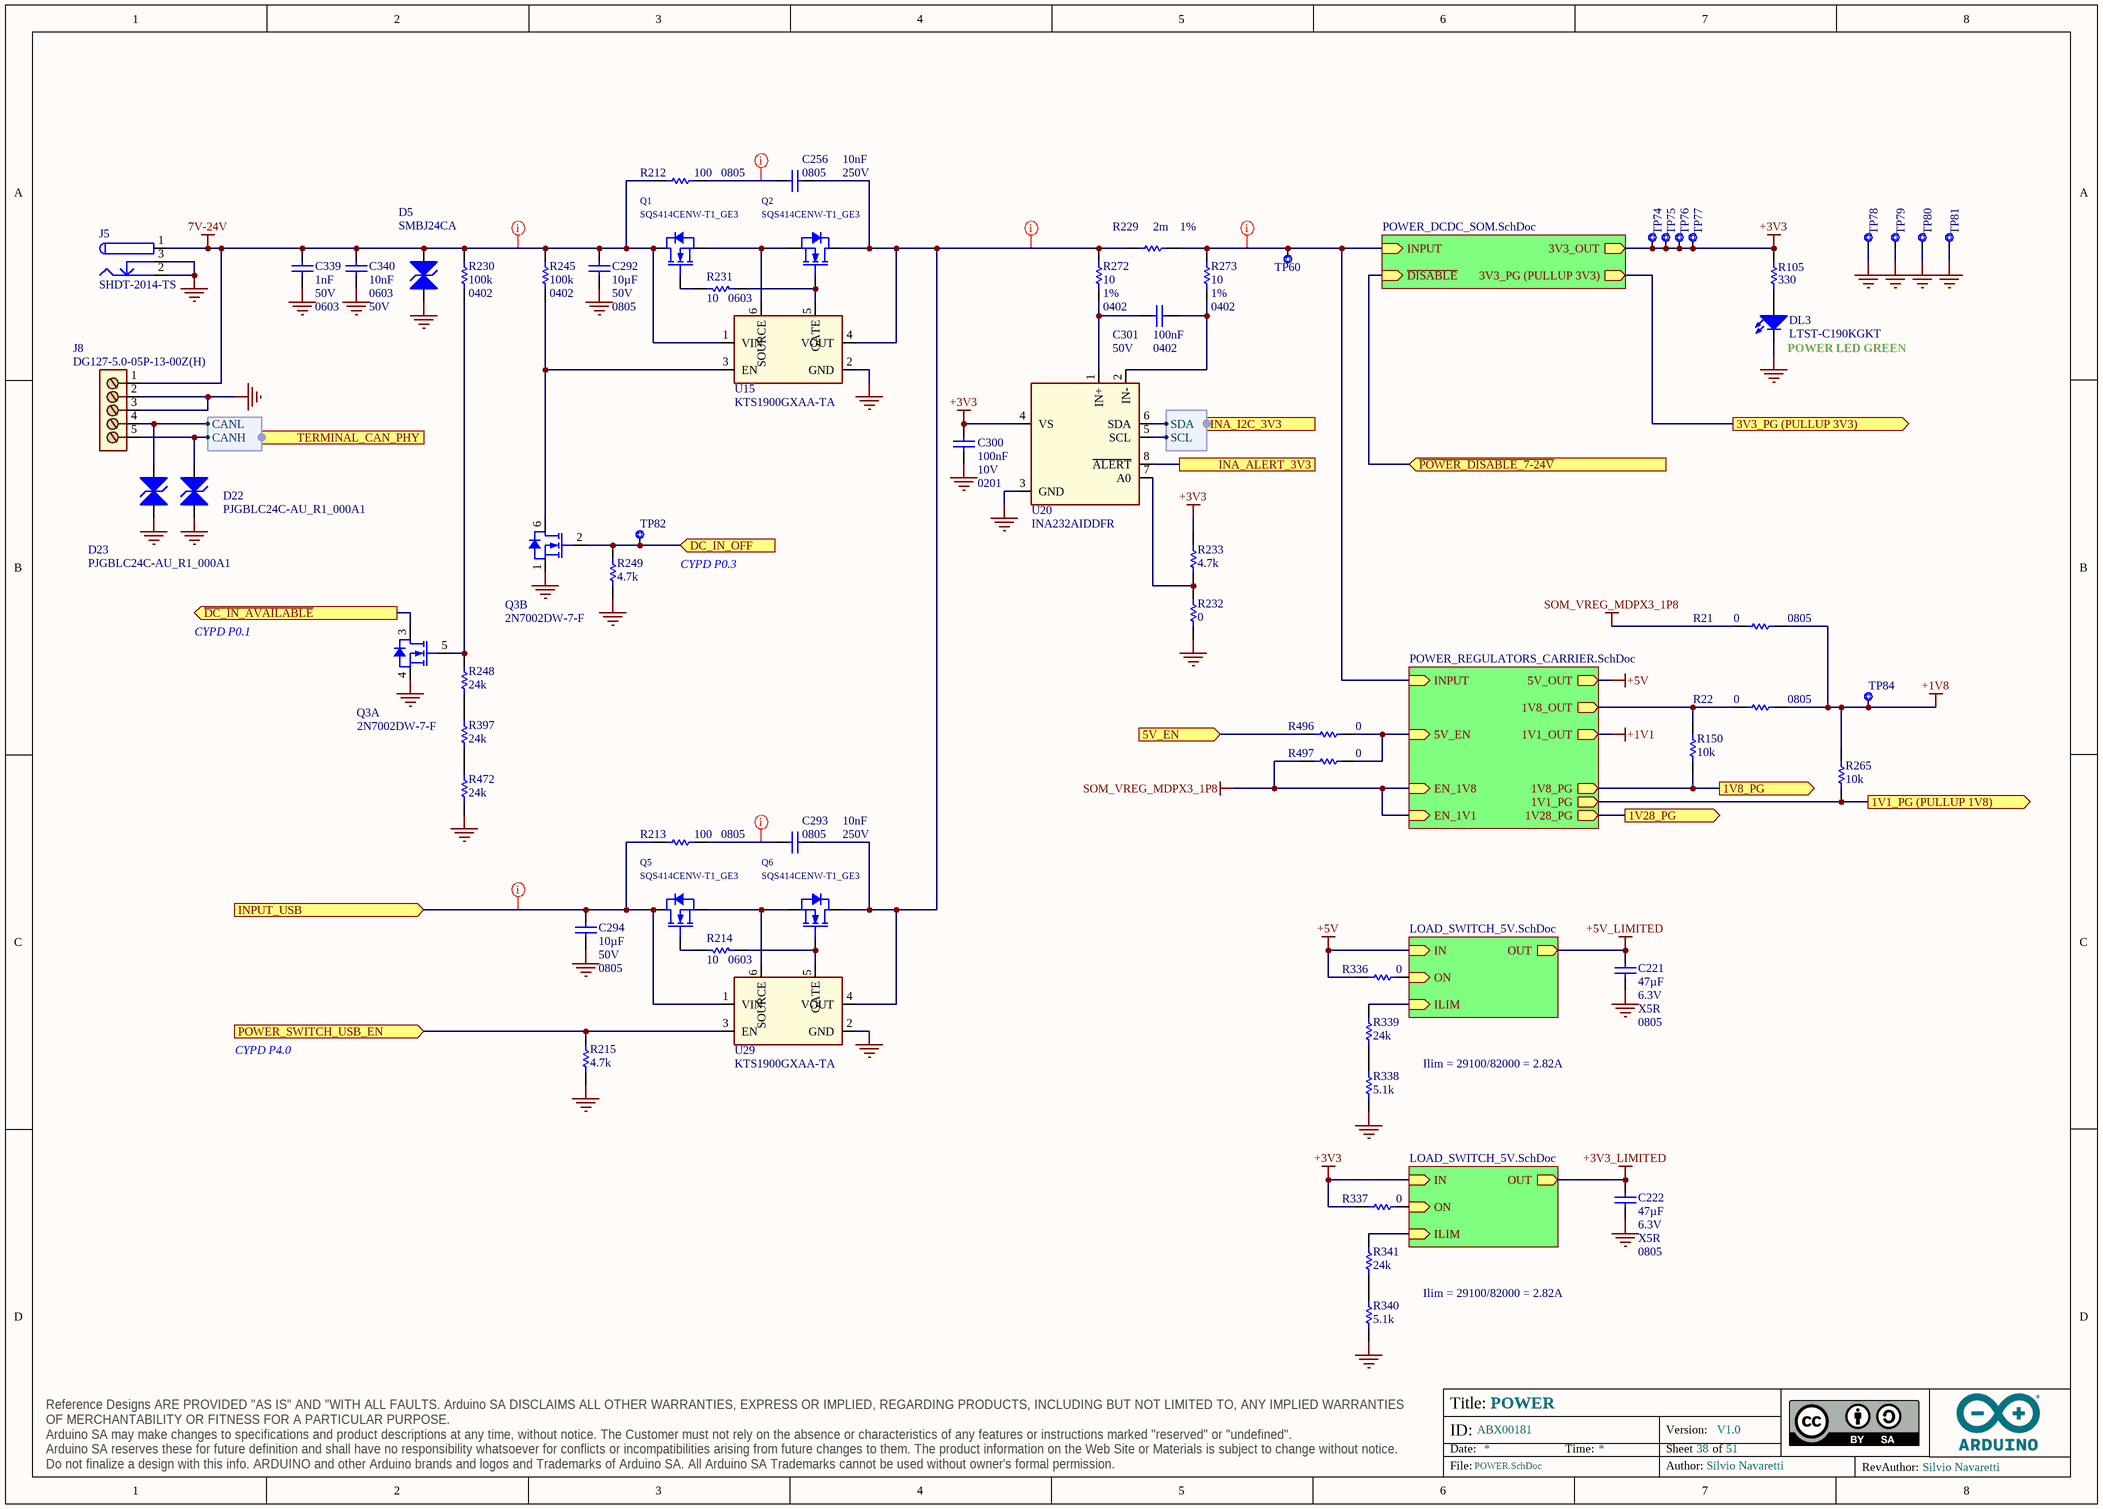
[diagram p22: POWER.SchDoc]

### Parts
C221  value 47µF  Voltage: 6.3V  Dielectric: X5R  Case Code (Imperial): 0805  [CAP-0805]  (hidden comment: C0805C476M9PAC7800)
C222  value 47µF  Voltage: 6.3V  Dielectric: X5R  Case Code (Imperial): 0805  [CAP-0805]  (hidden comment: C0805C476M9PAC7800)
C256  value 10nF  Case Code (Imperial): 0805  Voltage: 250V  [CAP-0805]  (hidden comment: GRM21BR72E103KW03L)
C292  value 10µF  Voltage: 50V  Case Code (Imperial): 0805  [CAP-0805]  (hidden comment: GRM21BR61H106ME43L)
C293  value 10nF  Case Code (Imperial): 0805  Voltage: 250V  [CAP-0805]  (hidden comment: GRM21BR72E103KW03L)
C294  value 10µF  Voltage: 50V  Case Code (Imperial): 0805  [CAP-0805]  (hidden comment: GRM21BR61H106ME43L)
C300  value 100nF  Voltage: 10V  Case Code (Imperial): 0201  [CAP-0201]  (hidden comment: CL03A104KP3NNNC)
C301  value 100nF  Voltage: 50V  Case Code (Imperial): 0402  [CAP-0402]  (hidden comment: GRM155R61H104KE19D)
C339  value 1nF  Voltage: 50V  Case Code (Imperial): 0603  [CAP-0603]  (hidden comment: CL10B102KB8WPNC)
C340  value 10nF  Case Code (Imperial): 0603  Voltage: 50V  [CAP-0603]  (hidden comment: 0603B103K500CT)
D5  SMBJ24CA  [SMB_NOPOLARITY]
D22  PJGBLC24C-AU_R1_000A1  [SOD323 NO POLARITY]
D23  PJGBLC24C-AU_R1_000A1  [SOD323 NO POLARITY]
DL3  LTST-C190KGKT  [LEDC1608X80N-AK]
J5  SHDT-2014-TS  [SHDT-2014-TS]
J8  DG127-5.0-05P-13-00Z(H)  [DG127-5.0-05P-13-00Z(H)]
Q1  SQS414CENW-T1_GE3  [SQS414CENW-T1_GE3]
Q2  SQS414CENW-T1_GE3  [SQS414CENW-T1_GE3]
Q3  2N7002DW-7-F  [SOT363]  (parts A,B of 2)
Q5  SQS414CENW-T1_GE3  [SQS414CENW-T1_GE3]
Q6  SQS414CENW-T1_GE3  [SQS414CENW-T1_GE3]
R21  value 0  Case Code (Imperial): 0805  [RES-0805]  (hidden comment: RC0805FR-070RL)
R22  value 0  Case Code (Imperial): 0805  [RES-0805]  (hidden comment: RC0805FR-070RL)
R105  value 330  [RES-0201]  (hidden comment: AC0201FR-07330RL)
R150  value 10k  [RES-0201]  (hidden comment: RC0201FR-0710KL)
R212  value 100  Case Code (Imperial): 0805  [RES-0805]  (hidden comment: RC0805FR-07100RL)
R213  value 100  Case Code (Imperial): 0805  [RES-0805]  (hidden comment: RC0805FR-07100RL)
R214  value 10  Case Code (Imperial): 0603  [RES-0603]  (hidden comment: CRCW060310R0FKEAC)
R215  value 4.7k  [RES-0201]  (hidden comment: RC0201FR-074K7L)
R229  value 2m  Tolerance: 1%  [RES-0805]  (hidden comment: PMR10EZPFV2L00)
R230  value 100k  Case Code (Imperial): 0402  [RES-0402]  (hidden comment: CRCW0402100KFKEDC)
R231  value 10  Case Code (Imperial): 0603  [RES-0603]  (hidden comment: CRCW060310R0FKEAC)
R232  value 0  [RES-0201]  (hidden comment: CRCW02010000Z0ED)
R233  value 4.7k  [RES-0201]  (hidden comment: RC0201FR-074K7L)
R245  value 100k  Case Code (Imperial): 0402  [RES-0402]  (hidden comment: CRCW0402100KFKEDC)
R248  value 24k  [RES-0201]  (hidden comment: RC0201FR-0724KL)
R249  value 4.7k  [RES-0201]  (hidden comment: RC0201FR-074K7L)
R265  value 10k  [RES-0201]  (hidden comment: RC0201FR-0710KL)
R272  value 10  Tolerance: 1%  Case Code (Imperial): 0402  [RES-0402]  (hidden comment: RC0402FR-0710RL)
R273  value 10  Tolerance: 1%  Case Code (Imperial): 0402  [RES-0402]  (hidden comment: RC0402FR-0710RL)
R336  value 0  [RES-0201]  (hidden comment: CRCW02010000Z0ED)
R337  value 0  [RES-0201]  (hidden comment: CRCW02010000Z0ED)
R338  value 5.1k  [RES-0201]  (hidden comment: ERJ-1GNF5101C)
R339  value 24k  [RES-0201]  (hidden comment: RC0201FR-0724KL)
R340  value 5.1k  [RES-0201]  (hidden comment: ERJ-1GNF5101C)
R341  value 24k  [RES-0201]  (hidden comment: RC0201FR-0724KL)
R397  value 24k  [RES-0201]  (hidden comment: RC0201FR-0724KL)
R472  value 24k  [RES-0201]  (hidden comment: RC0201FR-0724KL)
R496  value 0  [RES-0201]  (hidden comment: CRCW02010000Z0ED)
R497  value 0  [RES-0201]  (hidden comment: CRCW02010000Z0ED)
TP60  Test point 1.00mm  [TP-1.00MM]  (value not drawn)  (no BOM)
TP74  Test point 1.00mm  [TP-1.00MM]  (value not drawn)  (no BOM)
TP75  Test point 1.00mm  [TP-1.00MM]  (value not drawn)  (no BOM)
TP76  Test point 1.00mm  [TP-1.00MM]  (value not drawn)  (no BOM)
TP77  Test point 1.00mm  [TP-1.00MM]  (value not drawn)  (no BOM)
TP78  Test point 1.00mm  [TP-1.00MM]  (value not drawn)  (no BOM)
TP79  Test point 1.00mm  [TP-1.00MM]  (value not drawn)  (no BOM)
TP80  Test point 1.00mm  [TP-1.00MM]  (value not drawn)  (no BOM)
TP81  Test point 1.00mm  [TP-1.00MM]  (value not drawn)  (no BOM)
TP82  Test point 1.00mm  [TP-1.00MM]  (value not drawn)  (no BOM)
TP84  Test point 1.00mm  [TP-1.00MM]  (value not drawn)  (no BOM)
U15  KTS1900GXAA-TA  [SOT23-6 PITCH 0.95]
U20  INA232AIDDFR  [TI DDF SOT23-THIN 8 pin 1.6x2.9x1.1 mm heigth]
U29  KTS1900GXAA-TA  [SOT23-6 PITCH 0.95]

### Sub-sheets
U_LOAD_SWITCH_5V = LOAD_SWITCH_5V.SchDoc: IN (in), OUT (out), ON (in), ILIM (in)
U_LOAD_SWITCH_5V = LOAD_SWITCH_5V.SchDoc: IN (in), OUT (out), ON (in), ILIM (in)
U_POWER_DCDC_CARRIER = POWER_REGULATORS_CARRIER.SchDoc: INPUT (in), 5V_EN (in), 1V8_PG (out), 1V8_OUT (out), 1V1_OUT (out), 5V_OUT (out), 1V28_PG (out), 1V1_PG (out), EN_1V8 (in), EN_1V1 (in)
U_POWER_SOM = POWER_DCDC_SOM.SchDoc: 3V3_OUT (out), INPUT (in), ~{DISABLE} (in), 3V3_PG (PULLUP 3V3) (out)

### Ports
1V1_PG (PULLUP 1V8) (out), 1V8_PG (out), 1V28_PG (out), 3V3_PG (PULLUP 3V3) (out), 5V_EN (in), DC_IN_OFF (in), INA_ALERT_3V3, INA_I2C_3V3 (harness I2C), INPUT_USB (in), POWER_SWITCH_USB_EN (in), TERMINAL_CAN_PHY (harness CAN_PHY), ~{DC_IN_AVAILABLE} (out), ~{POWER_DISABLE_7-24V} (in)

### Harnesses
CAN_PHY: CANH, CANL
I2C: SDA, SCL

### Nets
7V-24V: C292.2 C339.1 C340.1 D5.2(A2) J5.1 J8.1 Q1.D R212.2 R230.1 R245.1 U15.1(VIN)
+1V8: R21.2 R22.2 R265.1 TP84.X
+3V3: C300.2 R105.2 R233.1 R337.1 TP74.X TP75.X TP76.X TP77.X U20.4(VS) ; sheet U_POWER_SOM/3V3_OUT, sheet U_LOAD_SWITCH_5V/IN
+3V3_LIMITED: C222.2 ; sheet U_LOAD_SWITCH_5V/OUT
+5V: R336.1 ; sheet U_POWER_DCDC_CARRIER/5V_OUT, sheet U_LOAD_SWITCH_5V/IN
+5V_LIMITED: C221.2 ; sheet U_LOAD_SWITCH_5V/OUT
GND: C221.1 C222.1 C292.1 C294.1 C300.1 C339.2 C340.2 D5.1(A1) D22.1(A1) D23.1(A1) DL3.C J5.2 J5.3 J8.2 J8.3 Q3.1(S) Q3.4(S) R215.2 R232.1 R249.2 R338.1 R340.1 R472.1 TP78.X TP79.X TP80.X TP81.X U15.2(GND) U20.3(GND) U29.2(GND)
SOM_VREG_MDPX3_1P8: R21.1 R497.2 ; sheet U_POWER_DCDC_CARRIER/EN_1V8, sheet U_POWER_DCDC_CARRIER/EN_1V1
1V05_PG (PULLUP 1V8): R265.2 ; port 1V1_PG (PULLUP 1V8), sheet U_POWER_DCDC_CARRIER/1V1_PG
3V3_PG (PULLUP 3V3): port 3V3_PG (PULLUP 3V3), sheet U_POWER_SOM/3V3_PG (PULLUP 3V3)
MD_GPIO_49: R496.2 ; port 5V_EN
MD_QUP1_SE4_I2C_3V3.SCL: U20.5(SCL) ; port INA_I2C_3V3.SCL
MD_QUP1_SE4_I2C_3V3.SDA: U20.6(SDA) ; port INA_I2C_3V3.SDA
~{POWER_DISABLE_7-24V}: port ~{POWER_DISABLE_7-24V}, sheet U_POWER_SOM/~{DISABLE}
PA_VBUS: C294.2 Q5.D R213.2 U29.1(VIN) ; port INPUT_USB
NetC76_1: R229.2 R273.2 TP60.X ; sheet U_POWER_SOM/INPUT, sheet U_POWER_DCDC_CARRIER/INPUT
NetC119_2: R22.1 R150.1 ; sheet U_POWER_DCDC_CARRIER/1V8_OUT
NetC256_1: C256.1 R212.1
NetC256_2: C256.2 C293.2 Q2.D Q6.D R229.1 R272.2 U15.4(VOUT) U29.4(VOUT)
NetC293_1: C293.1 R213.1
NetC301_1: C301.1 R272.1 U20.1(IN+)
NetC301_2: C301.2 R273.1 U20.2(IN-)
NetC342_1: D22.2(A2) J8.5 ; port TERMINAL_CAN_PHY.CANH
NetC345_2: R496.1 R497.1 ; sheet U_POWER_DCDC_CARRIER/5V_EN
NetC361_1: D23.2(A2) J8.4 ; port TERMINAL_CAN_PHY.CANL
NetDL3_A: DL3.A R105.1
NetQ1_G: Q1.G R231.2
NetQ1_S: Q1.S Q2.S U15.6(SOURCE)
NetQ2_G: Q2.G R231.1 U15.5(GATE)
NetQ3_2: Q3.2(G) R249.1 TP82.X ; port DC_IN_OFF
NetQ3_3: Q3.3(D) ; port ~{DC_IN_AVAILABLE}
NetQ3_5: Q3.5(G) R230.2 R248.2
NetQ3_6: Q3.6(D) R245.2 U15.3(EN)
NetQ5_G: Q5.G R214.2
NetQ5_S: Q5.S Q6.S U29.6(SOURCE)
NetQ6_G: Q6.G R214.1 U29.5(GATE)
NetR150_2: R150.2 ; port 1V8_PG, sheet U_POWER_DCDC_CARRIER/1V8_PG
NetR215_1: R215.1 U29.3(EN) ; port POWER_SWITCH_USB_EN
NetR232_2: R232.2 R233.2 U20.7(A0)
NetR248_1: R248.1 R397.2
NetR336_2: R336.2 ; sheet U_LOAD_SWITCH_5V/ON
NetR337_2: R337.2 ; sheet U_LOAD_SWITCH_5V/ON
NetR338_2: R338.2 R339.1
NetR339_2: R339.2 ; sheet U_LOAD_SWITCH_5V/ILIM
NetR340_2: R340.2 R341.1
NetR341_2: R341.2 ; sheet U_LOAD_SWITCH_5V/ILIM
NetR397_1: R397.1 R472.2
NetU18_5: port 1V28_PG, sheet U_POWER_DCDC_CARRIER/1V28_PG
NetU20_8: U20.8(~{ALERT}) ; port INA_ALERT_3V3

### Layout directives
net class HIGH_CLEARANCE: 7V-24V, NetC76_1, NetC256_1, NetC256_2, NetC293_1, PA_VBUS

### Notes on the sheet
- (near DL3) POWER LED GREEN
- CYPD P0.3
- CYPD P0.1
- CYPD P4.0
- Ilim = 29100/82000 = 2.82A
- Title:
- ID:
- Date:
- Time:
- Version:
- Sheet
- of
- RevAuthor:
- Reference Designs ARE PROVIDED "AS IS" AND "WITH ALL FAULTS. Arduino SA DISCLAIMS ALL OTHER WARRANTIES, EXPRESS OR IMPLIED, REGARDING PRODUCTS, INCLUDING BUT NOT LIMITED TO, ANY IMPLIED WARRANTIES OF MERCHANTABILITY OR FITNESS FOR A PARTICULAR PURPOSE.
  Arduino SA may make changes to specifications and product descriptions at any time, without notice. The Customer must not rely on the absence or characteristics of any features or instructions marked "reserved" or "undefined".
  Arduino SA reserves these for future definition and shall have no responsibility whatsoever for conflicts or incompatibilities arising from future changes to them. The product information on the Web Site or Materials is subject to change without notice.
  Do not finalize a design with this info. ARDUINO and other Arduino brands and logos and Trademarks of Arduino SA. All Arduino SA Trademarks cannot be used without owner's formal permission.
- File:
- Author:

### Library data of the parts
C221 C222 = C0199-A.1: CAP CHIP 0805 47uF 20% 6.3V X5R; Manufacturer: KEMET; Code Arduino: C0199; Technology: Ceramic; Tolerance: 20%; Part Number: C0805C476M9PAC7800
C256 C293 = C0209-A.1: CAP CHIP 0805 10nF 250V X7R; Manufacturer: Murata; Tolerance: 10%; Code Arduino: C0209; Part Number: GRM21BR72E103KW03L; Dielectric: X7R; Technology: Ceramic
C292 C294 = C0158-A.3: as C73 on sheet ETH_PHY; Dielectric: X5R; Technology: SMD; Part Number: GRM21BR61H106ME43L; Tolerance: 20%
C300 = C0113-A.6: as C4-C8 on sheet ETH_PHY; Technology: Ceramic; Part Number: CL03A104KP3NNNC; Dielectric: X5R; Tolerance: 10%
C301 = C0015-A.14: CAP CHIP 0402 100nF 10% 50V X5R; Manufacturer: Murata; Code Arduino: A5141; Part Number: GRM155R61H104KE19D; Dielectric: X5R; Tolerance: 10%; Technology: Ceramic
C339 = C0063-A.3: CAP CHIP 0603 1nF 10% 50V X7R; Manufacturer: Samsung Electro-Mechanics; Code Arduino: C0063; Tolerance: 10%; Part Number: CL10B102KB8WPNC; Dielectric: X7R
C340 = C0040-A.14: CAP CHIP 0603 10nF 10% 50V X7R; Manufacturer: Walsin; Code Arduino: 0142; Technology: Ceramic; Part number 3: CL10B103KC8NNNC; Part Number: 0603B103K500CT; Dielectric: X7R; Manufacturer 2: Hottech; Part number 2: C1608B103K500NT; Tolerance: 10%
D5 = D0070-A.2: as D2 on sheet HEADERS_UNO; Manufacturer 2: Bourns; Part Number: SMBJ24CA; Manufacturer 3: Hottech
D22 D23 = D0098-A.2: TVS BIDIRECTIONAL SMD Vr 24V, Vbr min 27.27V, 350W, SOD-323; V(BR) Typ (V): 26.7; Code Arduino: D0098; Part Number: PJGBLC24C-AU_R1_000A1
DL3 = L0009-A.6: LED SMD 0603 GREEN/568 15mcd 120^; Manufacturer: Liteon; Code Arduino: 2204; Pin Count: 2; Part Number: LTST-C190KGKT
J5 = J0579-A.2: CONN PWR JACK TH 2.1X5.5mm 1.6mm PCB; Manufacturer: POWERWAY; Code Arduino: J0579; Part Number: SHDT-2014-TS
J8 = J0563-A.5: CONN SCREW TERMINAL 5 POS pitch 5mm height 13.6mm BLACK; Manufacturer: Degson; Code Arduino: J0563; Part Number: DG127-5.0-05P-13-00Z(H)
Q1 Q2 Q5 Q6 = T0065-2: MOSFET N-CH 60V 18A PowerPAK 1212-8W 3.3x3.3mm; Manufacturer: Vishay; Code Arduino: T0065; Part Number: SQS414CENW-T1_GE3
Q3 = T0011-A.12: MOSFET 2N-CH 60V 0.32A SOT363; Manufacturer: Diodes Inc.; Device Type: Mosfet 2N-CH SMD; Code Arduino: A5500; Manufacturer 2: Nexperia; Manufacturer Part Number 2: 2N7002PS,115; Pin Count: 6; Part Number: 2N7002DW-7-F
R21 R22 = R0323-A.1: RES CHIP 0805 0R 1% 1/8W; Manufacturer: YAGEO; Code Arduino: R0323; Power: 125mW; Temperature coefficient: 0ppm; Technology: Thick film; Part Number: RC0805FR-070RL; Tolerance: 1%
R105 = R0149-A.21: RES CHIP 0201 330R 1% 1/20W; Manufacturer: Yageo; Power: 50mW; Code Arduino: R0149; Temperature coefficient: 200ppm; Case Code (Imperial): 0201; Manufacturer 2: Samsung Electro-Mechanics; Tolerance: 1%; Part Number: AC0201FR-07330RL; Technology: Thick film
R150 R265 = R0145-A.21: RES CHIP 0201 10k 1% 1/20W; Manufacturer: Yageo; Power: 50mW; Temperature coefficient: 200ppm; Code Arduino: R0145; Manufacturer 2: Samsung Electro-Mechanics; Tolerance: 1%; Case Code (Imperial): 0201; Part Number: RC0201FR-0710KL; Technology: Thick film
R212 R213 = R0130-A.14: RES CHIP 0805 100R 1% 1/8W 100ppm; Manufacturer: YAGEO; Power: 125mW; Code Arduino: R0130; Part Number: RC0805FR-07100RL; Tolerance: 1%; Technology: Thick film; Temperature coefficient: 100ppm
R214 R231 = R0188-A.20: RES CHIP 0603 10R 1% 1/10W; Manufacturer: Vishay; Temperature coefficient: 100ppm; Code Arduino: R0188; Power: 100mW; Part Number: CRCW060310R0FKEAC; Tolerance: 1%; Technology: Thick film
R215 R233 R249 = R0151-A.21: as R62-R68 on sheet ETH_PHY; Technology: Thick film; Case Code (Imperial): 0201; Part Number: RC0201FR-074K7L; Tolerance: 1%
R229 = R0132-A.12: RES CHIP 0805 2mR 1% 1/2W; Manufacturer: ROHM Semiconductor; Power: 500mW; Code Arduino: A5411; Temperature coefficient: 150ppm; Case Code (Imperial): 0805; Part Number: PMR10EZPFV2L00; Technology: Metal element
R230 R245 = R0001-A.24: RES CHIP 0402 100k 1% 1/16W; Manufacturer: Vishay; Power: 62.5mW; Code Arduino: 0134; Temperature coefficient: 100ppm; Tolerance: 1%; Part Number: CRCW0402100KFKEDC; Technology: Thick film
R232 R336 R337 R496 R497 = R0140-A.21: as R284 on sheet ETH_PHY; Technology: Thick film; Case Code (Imperial): 0201; Part Number: CRCW02010000Z0ED
R248 R397 R472 = R0398-A.1: RES CHIP 0201 24k 1% 1/20W; Manufacturer: YAGEO; Power: 50mW; Code Arduino: R0398; Temperature Coefficient: 200ppm; Case Code (Imperial): 0201; Part Number: RC0201FR-0724KL; Technology: Thick film; Tolerance: 1%
R272 R273 = R0170-A.23: RES CHIP 0402 10R 1% 1/16W; Manufacturer: YAGEO; Power: 62.5mW; Temperature coefficient: 200ppm; Code Arduino: R0170; Technology: Thick film; Part Number: RC0402FR-0710RL
R338 R340 = R0376-A.1: RES CHIP 0201 5k1 1% 1/20W; Manufacturer: Panasonic; Code Arduino: R0376; Power: 50mW; Temperature Coefficient: 200ppm; Technology: Thick film; Part Number: ERJ-1GNF5101C; Case Code (Imperial): 0201; Tolerance: 1%
R339 R341 = R0398-A.1: RES CHIP 0201 24k 1% 1/20W; Manufacturer: YAGEO; Code Arduino: R0398; Power: 50mW; Temperature Coefficient: 200ppm; Technology: Thick film; Part Number: RC0201FR-0724KL; Case Code (Imperial): 0201; Tolerance: 1%
TP60 TP74-TP82 TP84 = UT0013-A.6: Part Number: This is not a component; Design Item ID: CMP-018-0005-A.3; Source: ut.SchLib; Manufacturer: This is not a component; Code Arduino: This is not a component; Pin Count: 1
U15 U29 = U0502-A.3: IC Ideal diode and load switch controller with reverse input protection, 4.2V to 60V, EN pin 1.32V, SOT23-6; Manufacturer: Kinetic Technology; Code Arduino: U0502; Part Number: KTS1900GXAA-TA
U20 = U0519-A.2: IC MONITOR PWR/CURR/VOLT 16bit ADC I2C SOT23-THIN8 1.6x2.9x1.1 mm; Manufacturer: Texas Instruments; Code Arduino: U0519; Part Number: INA232AIDDFR